# EAGLE design CanSwitch (EAGLE 7.7.0)
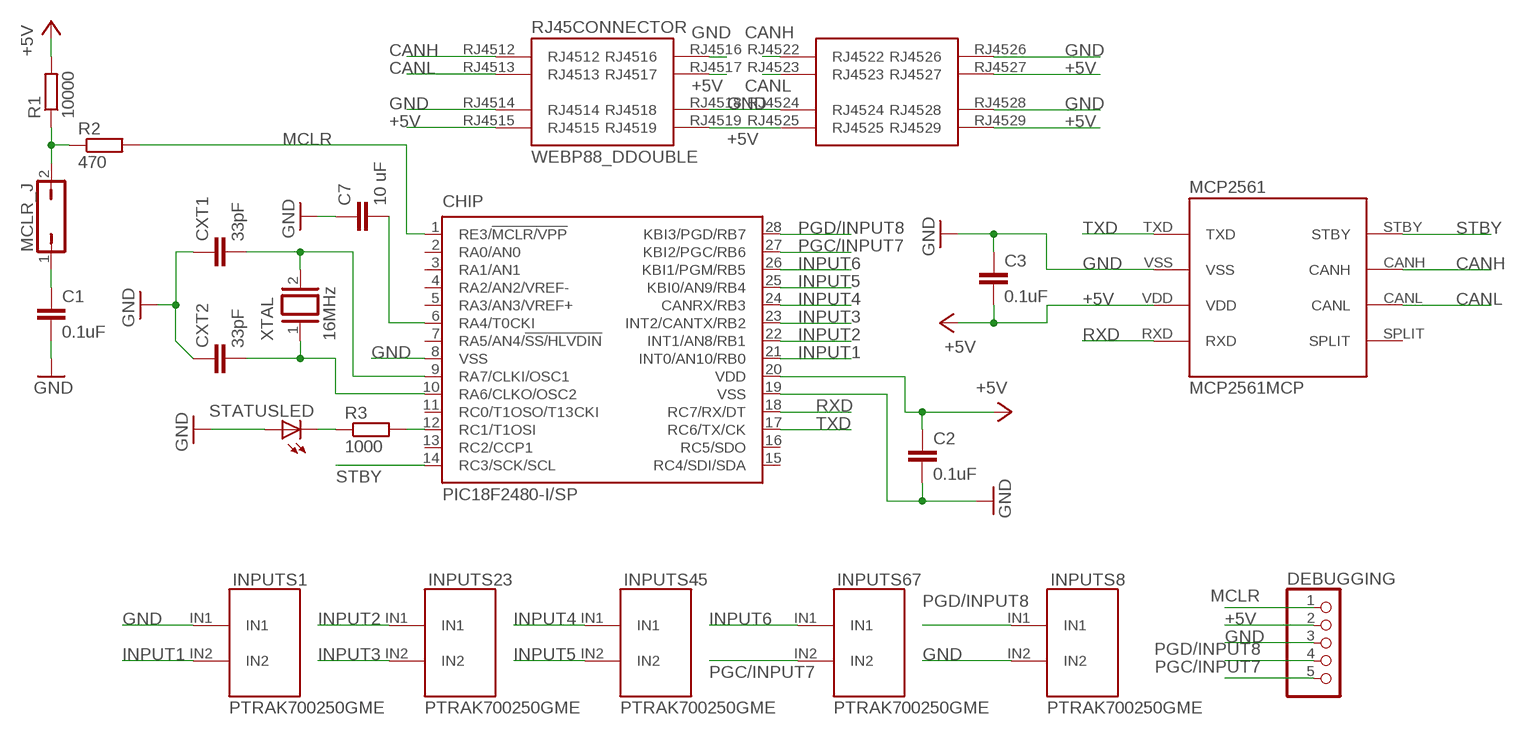
[diagram p0: schematic, sheet 1]

## Parts
C1  0.1uF  C-EU025-025X050  [C025-025X050]
C2  0.1uF  C-EU050-025X075  [C050-025X075]
C3  0.1uF  C-EU050-025X075  [C050-025X075]
C7  10 uF  C-EU050-025X075  [C050-025X075]
CHIP  PIC18F2480-I/SP  [DIL28-3]
CXT1  33pF  C-EU025-030X050  [C025-030X050]
CXT2  33pF  C-EU025-030X050  [C025-030X050]
DEBUGGING  PINHD-1X5  [1X05]
INPUTS1  PTRAK700250GME  [PTR_AK700_2_5.0]
INPUTS8  PTRAK700250GME  [PTR_AK700_2_5.0]
INPUTS23  PTRAK700250GME  [PTR_AK700_2_5.0]
INPUTS45  PTRAK700250GME  [PTR_AK700_2_5.0]
INPUTS67  PTRAK700250GME  [PTR_AK700_2_5.0]
MCLR_J  JP1Q  [JP1]
MCP2561  MCP2561MCP  [MCP2561_PDIP]
R1  10000  R-EU_0207/10  [0207/10]
R2  470  R-EU_0207/10  [0207/10]
R3  1000  R-EU_0207/10  [0207/10]
RJ45CONNECTOR  WEBP88_DDOUBLE  [WEBP88_RJ45_DOUBLE]
STATUSLED  LED5MM  [LED5MM]
XTAL  16MHz  XTAL/S  [QS]

## Nets
+5V: C2.1 C3.2 CHIP.20(VDD) DEBUGGING.2 MCP2561.VDD R1.2 RJ45CONNECTOR.RJ4515 RJ45CONNECTOR.RJ4517 RJ45CONNECTOR.RJ4519 RJ45CONNECTOR.RJ4525 RJ45CONNECTOR.RJ4527 RJ45CONNECTOR.RJ4529
CANH: MCP2561.CANH RJ45CONNECTOR.RJ4512 RJ45CONNECTOR.RJ4522
CANL: MCP2561.CANL RJ45CONNECTOR.RJ4513 RJ45CONNECTOR.RJ4523
GND: C1.2 C2.2 C3.1 C7.1 CHIP.8(VSS) CHIP.19(VSS) CXT1.1 CXT2.1 DEBUGGING.3 INPUTS1.IN1 INPUTS8.IN2 MCP2561.VSS RJ45CONNECTOR.RJ4514 RJ45CONNECTOR.RJ4516 RJ45CONNECTOR.RJ4518 RJ45CONNECTOR.RJ4524 RJ45CONNECTOR.RJ4526 RJ45CONNECTOR.RJ4528 STATUSLED.A
INPUT1: CHIP.21(INT0/AN10/RB0) INPUTS1.IN2
INPUT2: CHIP.22(INT1/AN8/RB1) INPUTS23.IN1
INPUT3: CHIP.23(INT2/CANTX/RB2) INPUTS23.IN2
INPUT4: CHIP.24(CANRX/RB3) INPUTS45.IN1
INPUT5: CHIP.25(KBI0/AN9/RB4) INPUTS45.IN2
INPUT6: CHIP.26(KBI1/PGM/RB5) INPUTS67.IN1
MCLR: CHIP.1(RE3/!MCLR/VPP) DEBUGGING.1 R2.2
N$1: C1.1 MCLR_J.1
N$2: MCLR_J.2 R1.1 R2.1
N$4: C7.2 CHIP.6(RA4/T0CKI)
N$7: CHIP.12(RC1/T1OSI) R3.2
N$8: R3.1 STATUSLED.K(C)
OSC1: CHIP.9(RA7/CLKI/OSC1) CXT1.2 XTAL.2
OSC2: CHIP.10(RA6/CLKO/OSC2) CXT2.2 XTAL.1
PGC/INPUT7: CHIP.27(KBI2/PGC/RB6) DEBUGGING.5 INPUTS67.IN2
PGD/INPUT8: CHIP.28(KBI3/PGD/RB7) DEBUGGING.4 INPUTS8.IN1
RXD: CHIP.18(RC7/RX/DT) MCP2561.RXD
STBY: CHIP.14(RC3/SCK/SCL) MCP2561.STBY
TXD: CHIP.17(RC6/TX/CK) MCP2561.TXD
Unconnected: CHIP.2(RA0/AN0) CHIP.3(RA1/AN1) CHIP.4(RA2/AN2/VREF-) CHIP.5(RA3/AN3/VREF+) CHIP.7(RA5/AN4/!SS/HLVDIN) CHIP.11(RC0/T1OSO/T13CKI) CHIP.13(RC2/CCP1) CHIP.15(RC4/SDI/SDA) CHIP.16(RC5/SDO) MCP2561.SPLIT

## Library data of the parts
C1-C3 C7 CXT1 CXT2 = rcl:C-EU: CAPACITOR, European symbol
CHIP = microchip:PIC18F2*80: 28-Pin Enhanced Flash Microcontrollers with ECAN(TM) Technology 10-Bit A/D and nanoWatt Technology Source: http://www.microchip.com .. 39637a.pdf; MF: MICROCHIP; MPN: PIC18F2480-I/SP; OC_FARNELL: 9321217; OC_NEWARK: 71J7237
DEBUGGING = pinhead:PINHD-1X5: PIN HEADER
INPUTS1 INPUTS8 INPUTS23 INPUTS45 INPUTS67 = PoJD:PTRAK700250: Šroubovací svorkovnice do DPS, zelená. Počet kontaktů = 2 Rozteč kontaktů = 5mm Jmenovité napětí = 250V Jmenovitý proud = 24A Orientace vodiče = vertikální Možnost spojování = ano Výrobce PTR
MCLR_J = jumper:JP1Q: JUMPER
MCP2561 = PoJD:MCP2561: High-Speed CAN Transceiver See http://ww1.microchip.com/downloads/en/DeviceDoc/25167A.pdf The MCP2561/2 is a Microchip Technology Inc. second generation high-speed CAN transceiver. It serves as an interface between a CAN protocol controller and the physical two-wire CAN bus. The device meets the automotive requirements for high-speed (up to 1 Mb/s), low quiescent current, electromagnetic compatibility (EMC) and electrostatic discharge (ESD).
R1-R3 = rcl:R-EU_: RESISTOR, European symbol
RJ45CONNECTOR = PoJD:WEBP88_D: RJ konektor WEBP 8-8 SHIELDED DVOJITY. http://www.gme.cz/rj-konektor-webp-8-8-shielded-dvojity-p833-064
STATUSLED = led:LED: LED OSRAM: - CHIPLED LG R971, LG N971, LY N971, LG Q971, LY Q971, LO R971, LY R971 LH N974, LH R974 LS Q976, LO Q976, LY Q976 LO Q996 - Hyper CHIPLED LW Q18S LB Q993, LB Q99A, LB R99A - SideLED LS A670, LO A670, LY A670, LG A670, LP A670 LB A673, LV A673, LT A673, LW A673 LH A674 LY A675 LS A676, LA A676, LO A676, LY A676, LW A676 LS A679, LY A679, LG A679 - Hyper Micro SIDELED® LS Y876, LA Y876, LO Y876, LY Y876 LT Y87S - SmartLED LW L88C, LW L88S LB L89C, LB L89S, LG L890 LS L89K, LO L89K, LY L89K LS L896, LA L896, LO L896, LY L896 - TOPLED LS T670, LO T670, LY T670, LG T670, LP T670 LSG T670, LSP T670, LSY T670, LOP T670, LYG T670 LG T671, LOG T671, LSG T671 LB T673, LV T673, LT T673, LW T673 LH T674 LS T676, LA T676, LO T676, LY T676, LB T676, LH T676, LSB T676, LW T676 LB T67C, LV T67C, LT T67C, LS T67K, LO T67K, LY T67K, LW E67C LS E67B, LA E67B, LO E67B, LY E67B, LB E67C, LV E67C, LT E67C LW T67C LS T679, LY T679, LG T679 LS T770, LO T770, LY T770, LG T770, LP T770 LB T773, LV T773, LT T773, LW T773 LH T774 LS E675, LA E675, LY E675, LS T675 LS T776, LA T776, LO T776, LY T776, LB T776 LHGB T686 LT T68C, LB T68C - Hyper Mini TOPLED® LB M676 - Mini TOPLED Santana® LG M470 LS M47K, LO M47K, LY M47K Source: http://www.osram.convergy.de LUXEON: - LUMILED® LXK2-PW12-R00, LXK2-PW12-S00, LXK2-PW14-U00, LXK2-PW14-V00 LXK2-PM12-R00, LXK2-PM12-S00, LXK2-PM14-U00 LXK2-PE12-Q00, LXK2-PE12-R00, LXK2-PE12-S00, LXK2-PE14-T00, LXK2-PE14-U00 LXK2-PB12-K00, LXK2-PB12-L00, LXK2-PB12-M00, LXK2-PB14-N00, LXK2-PB14-P00, LXK2-PB14-Q00 LXK2-PR12-L00, LXK2-PR12-M00, LXK2-PR14-Q00, LXK2-PR14-R00 LXK2-PD12-Q00, LXK2-PD12-R00, LXK2-PD12-S00 LXK2-PH12-R00, LXK2-PH12-S00 LXK2-PL12-P00, LXK2-PL12-Q00, LXK2-PL12-R00 Source: www.luxeon.com KINGBRIGHT: KA-3528ASYC Source: www.kingbright.com
XTAL = special:XTAL/S: CRYSTAL

## Board
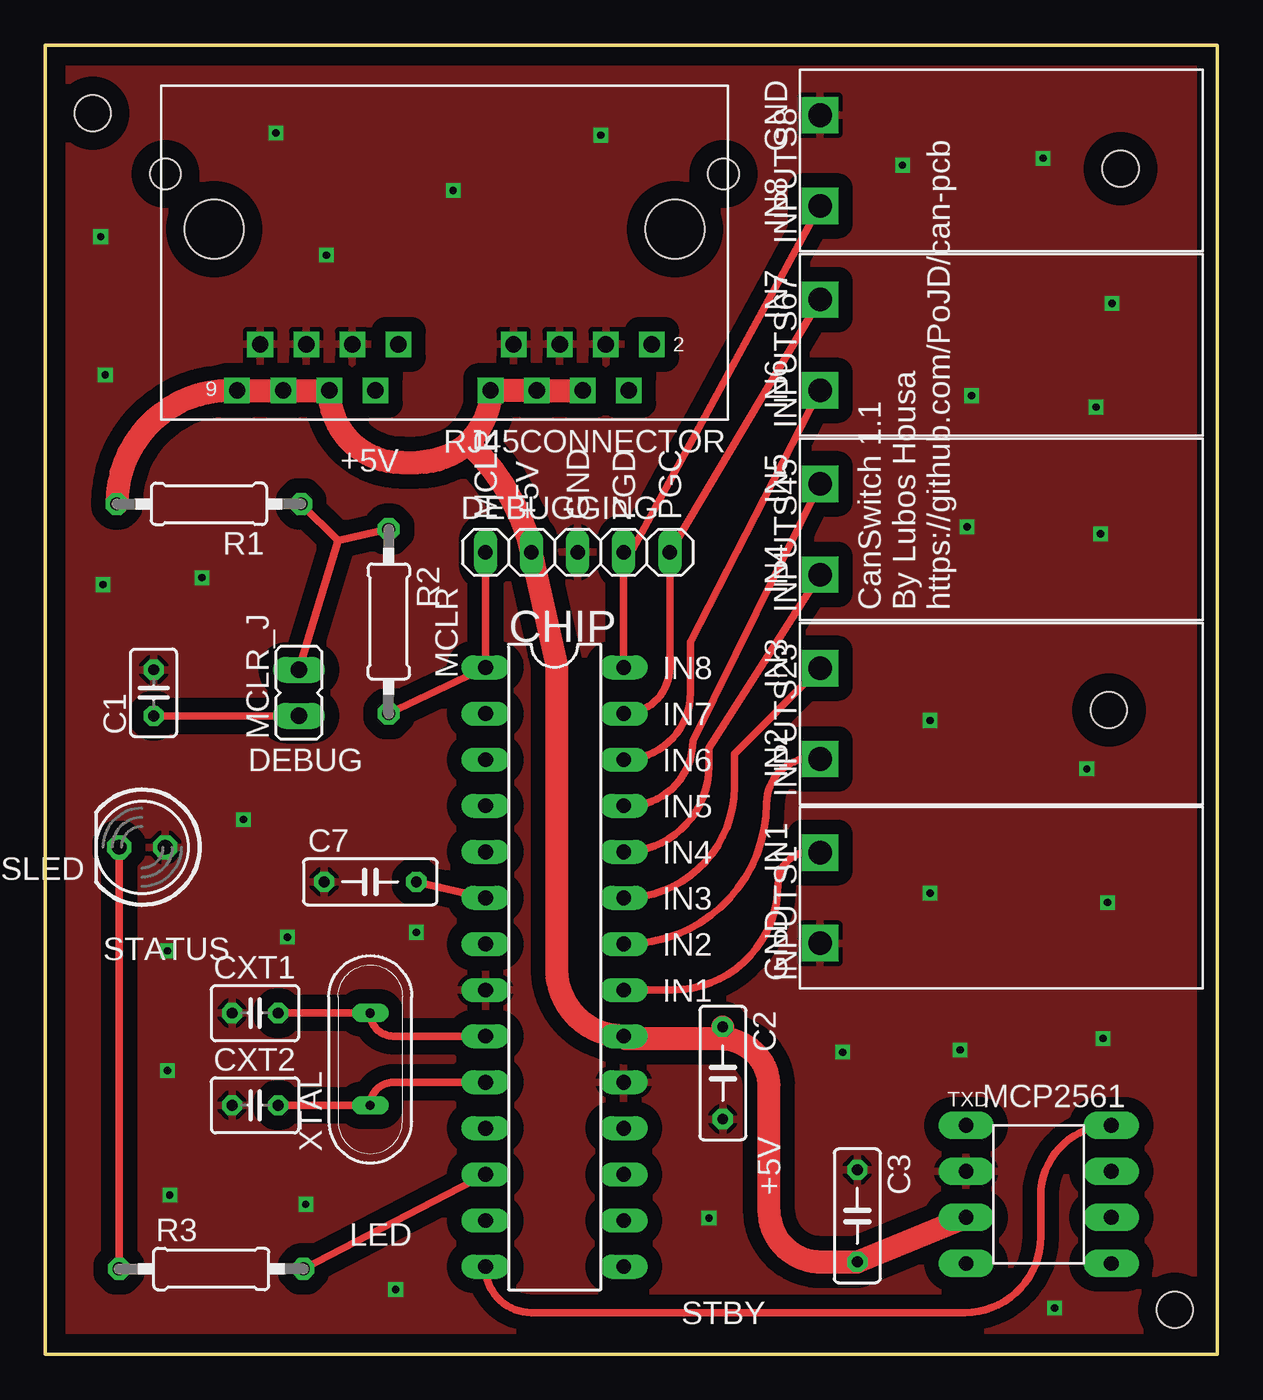
[diagram p1: board, top side]
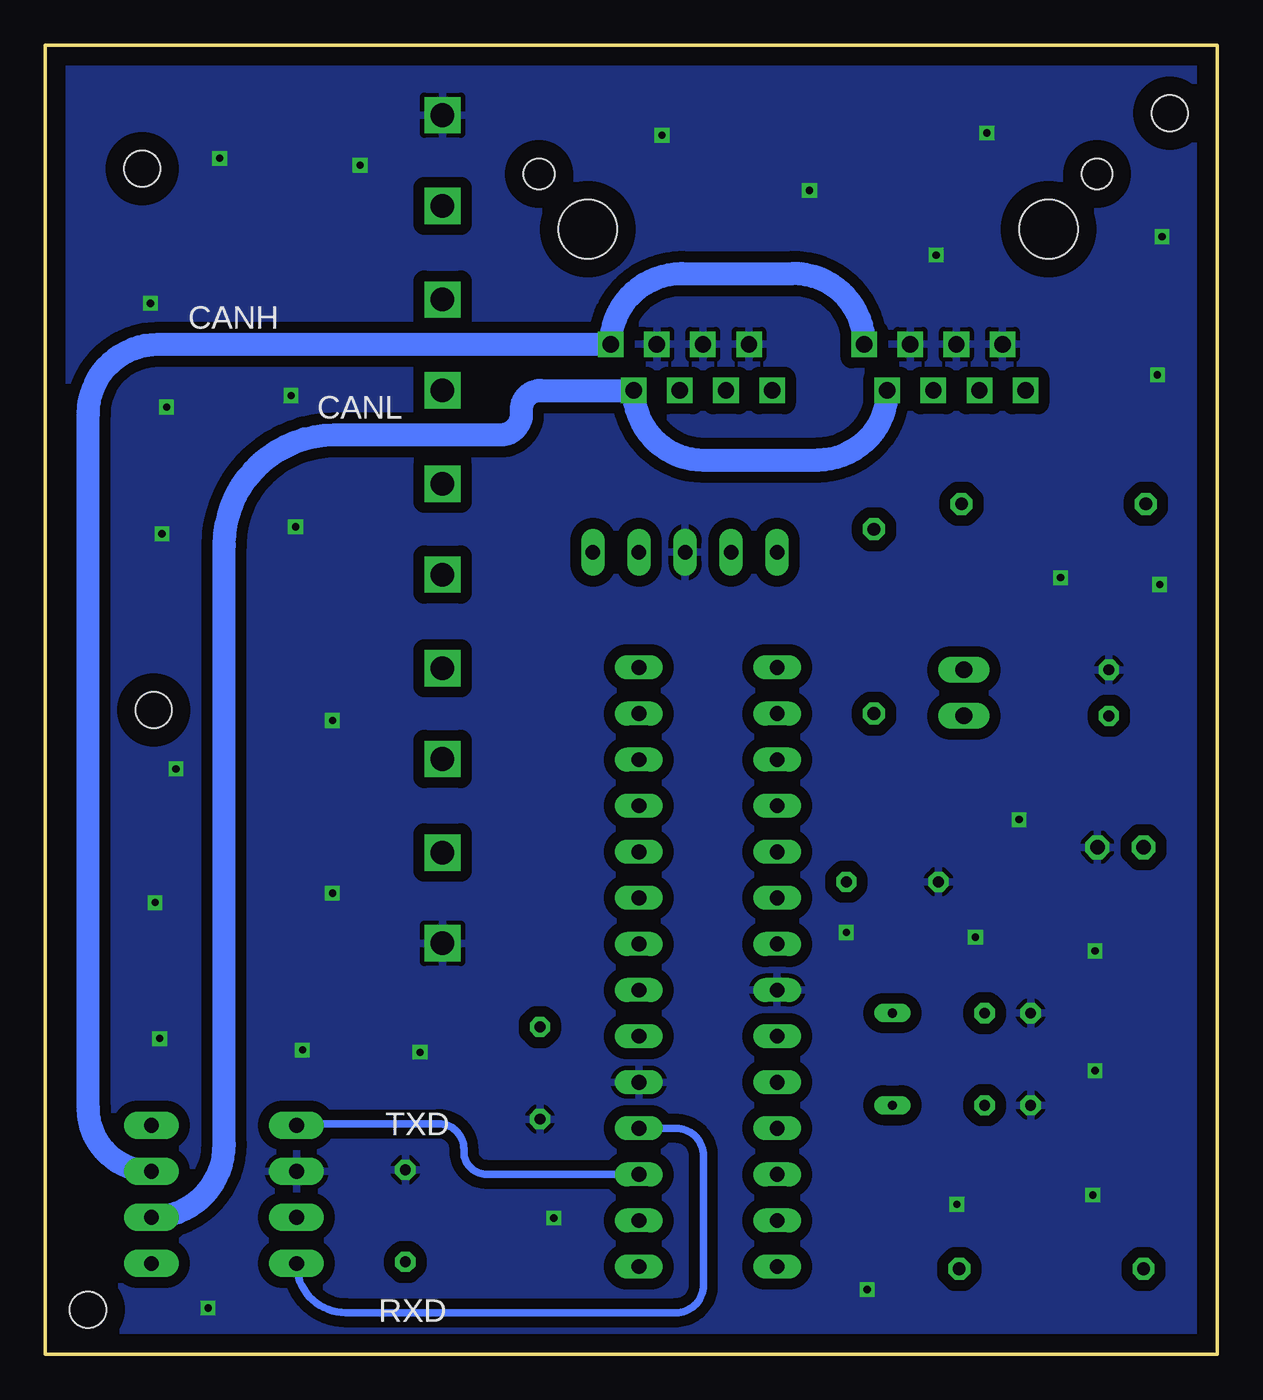
[diagram p2: board, bottom side, seen from below]

Size 64.59 x 72.14 mm. Coordinates in mm from the lower left corner, seen from the top.
Outline: 64.59,0 64.59,72.14 0,72.14 0,0 64.59,0
Copper layers (1*16): Top 0.035mm / dielectric 1.5mm / Bottom 0.035mm
Design rules "default *": minimum track width 10mil, minimum drill 0.3mm, track to track 8mil, track to pad 8mil, pad to pad 8mil, via to via 8mil, smd to smd 8mil, copper to edge 40mil, drill to drill 8mil, minimum pad ring 10mil, minimum via ring 8mil, stop-mask expansion 4mil, vias tented up to drill 0.41mm, thermal gap 10mil
Holes 2 mm at 2.62,68.39 62.25,2.46 58.63,35.5 59.26,65.34

### Footprints (pad centres in the part's own frame; a part is rotated, then mirrored left to right if it is on the bottom)
C025-025X050 = drill 0.6 octagon: 1 -1.27,0; 2 1.27,0
C050-025X075 = drill 0.6 octagon: 1 -2.54,0; 2 2.54,0
DIL28-3 = drill 0.813 long: 1 -16.51,-3.81; 2 -13.97,-3.81; 3 -11.43,-3.81; 4 -8.89,-3.81; 5 -6.35,-3.81; 6 -3.81,-3.81; 7 -1.27,-3.81; 8 1.27,-3.81; 9 3.81,-3.81; 10 6.35,-3.81; 11 8.89,-3.81; 12 11.43,-3.81; 13 13.97,-3.81; 14 16.51,-3.81; 15 16.51,3.81; 16 13.97,3.81; 17 11.43,3.81; 18 8.89,3.81; 19 6.35,3.81; 20 3.81,3.81; 21 1.27,3.81; 22 -1.27,3.81; 23 -3.81,3.81; 24 -6.35,3.81; 25 -8.89,3.81; 26 -11.43,3.81; 27 -13.97,3.81; 28 -16.51,3.81
C025-030X050 = drill 0.6 octagon: 1 -1.27,0; 2 1.27,0
1X05 = drill 0.8 long: 1 -5.08,0; 2 -2.54,0; 3 0,0; 4 2.54,0; 5 5.08,0
PTR_AK700_2_5.0 = drill 1.3 pad 2 square: IN1 -2.5,10; IN2 2.5,10
JP1 = drill 0.914 long: 1 0,-1.27; 2 0,1.27
MCP2561_PDIP = drill 0.813 pad 1.524 long: CANH 4,1.27; CANL 4,-1.27; RXD -4,-3.81; SPLIT 4,-3.81; STBY 4,3.81; TXD -4,3.81; VDD -4,-1.27; VSS -4,1.27
0207/10 = drill 0.7 octagon: 1 -5.08,0; 2 5.08,0
WEBP88_RJ45_DOUBLE = drill 0.9 square: RJ4512 -11.43,5.05; RJ4513 -10.16,7.59; RJ4514 -8.89,5.05; RJ4515 -7.62,7.59; RJ4516 -6.35,5.05; RJ4517 -5.08,7.59; RJ4518 -3.81,5.05; RJ4519 -2.54,7.59; RJ4522 2.54,5.05; RJ4523 3.81,7.59; RJ4524 5.08,5.05; RJ4525 6.35,7.59; RJ4526 7.62,5.05; RJ4527 8.89,7.59; RJ4528 10.16,5.05; RJ4529 11.43,7.59 | hole 3.25: -12.7,-1.3; 12.7,-1.3 | hole 1.7: -15.38,-4.35; 15.38,-4.35
LED5MM = drill 0.813 octagon: A -1.27,0; K 1.27,0
QS = drill 0.5 long: 1 -2.54,0; 2 2.54,0

### Placement (x,y rotation side)
C1  5.97,36.45 90 top
C2  37.34,15.49 270 top
C3  44.75,7.62 270 top
C7  17.91,26.04 0 top
CHIP  28.07,21.34 270 top
CXT1  11.56,18.8 0 top
CXT2  11.56,13.72 0 top
DEBUGGING  29.34,44.2 0 top
INPUTS1  52.7,25.15 90 top
INPUTS8  52.7,65.79 90 top
INPUTS23  52.7,35.31 90 top
INPUTS45  52.7,45.47 90 top
INPUTS67  52.7,55.63 90 top
MCLR_J  13.97,36.45 0 top
MCP2561  54.75,8.8 0 top
R1  9.02,46.86 180 top
R2  18.92,40.39 270 top
R3  9.14,4.7 0 top
RJ45CONNECTOR  22,60.71 180 top
STATUSLED  5.33,27.94 180 top
XTAL  17.91,16.26 90 top

### Tracks (layer width: path | path; a pad name or v marks a point on that pad's centre or on a via)
+5V
  Top 1.27: RJ45CONNECTOR.RJ4515 RJ45CONNECTOR.RJ4517 RJ45CONNECTOR.RJ4519 arc-90 20.57,49.15 | 37.21,17.4 32,17.4 arc-90 CHIP.20 arc-90 28.19,21.21 28.19,37.97 DEBUGGING.2 arc34 23.37,50.16 22.23,49.53 21.46,49.28 20.57,49.15 | 37.21,17.4 arc90 37.34,17.53 C2.1 | 37.21,17.4 arc-90 39.88,14.73 39.88,7.95 arc90 42.75,5.08 C3.2 MCP2561.VDD | R1.2 arc-90 10.19,53.12 RJ45CONNECTOR.RJ4529 RJ45CONNECTOR.RJ4527 RJ45CONNECTOR.RJ4525 arc90 19.62,49.15 20.57,49.15
CANH
  Bottom 1.27: RJ45CONNECTOR.RJ4522 arc-90 23.37,59.56 29.52,59.56 arc-90 RJ45CONNECTOR.RJ4512 58.39,55.66 arc-90 62.23,51.82 62.23,13.55 arc-90 MCP2561.CANH
CANL
  Bottom 1.27: RJ45CONNECTOR.RJ4523 arc90 22.03,49.28 28.32,49.28 arc90 RJ45CONNECTOR.RJ4513 37.31,53.12 arc-90 38.35,52.07 38.35,51.82 arc90 39.5,50.67 48.64,50.67 arc-90 54.74,44.58 54.74,11.55 arc90 MCP2561.CANL
GND  (via drill 0.4)
  other vias: 47.24,65.53 19.3,3.56 6.86,8.76 6.73,15.62 6.73,22.23 13.34,22.99 20.45,23.24 54.99,65.91 58.8,57.91 50.42,16.76 3.05,61.59 14.35,8.26 43.94,16.64 36.58,7.49 10.92,29.46 3.3,53.98 22.48,64.14 30.61,67.18 15.49,60.58 12.7,67.31 8.64,42.8 3.17,42.42 51.05,52.83 57.91,52.2 58.17,45.21 57.4,32.26 48.77,34.92 48.77,25.4 58.55,24.89 58.29,17.4 55.63,2.54 50.8,45.59
  pour Top (isolate 0.8): 0.5,71.64 64.09,71.64 64.09,0.5 0.5,0.5
  pour Bottom (isolate 0.6): 0.5,71.64 64.09,71.64 64.09,0.5 0.5,0.5
INPUT1
  Top 0.406: CHIP.21 34.54,20.07 arc90 40.39,25.91 arc-106 INPUTS1.IN2
INPUT2
  Top 0.406: CHIP.22 32,22.61 arc90 39.75,30.35 arc-101 INPUTS23.IN1
INPUT3
  Top 0.406: CHIP.23 arc90 37.97,31.24 37.97,33.07 INPUTS23.IN2
INPUT4
  Top 0.406: CHIP.24 arc90 36.58,32.38 36.58,33.4 INPUTS45.IN1
INPUT5
  Top 0.406: CHIP.25 32.13,30.23 arc90 35.69,33.78 INPUTS45.IN2
INPUT6
  Top 0.406: CHIP.26 arc90 35.56,36.45 35.56,39.24 INPUTS67.IN1
MCLR
  Top 0.406: DEBUGGING.1 CHIP.1 R2.2
N$1
  Top 0.406: MCLR_J.1 C1.1
N$2
  Top 0.406: MCLR_J.2 16.13,44.83 | 16.13,44.83 R2.1 | R1.1 16.13,44.83
N$4
  Top 0.406: CHIP.6 C7.2
N$7
  Top 0.406: CHIP.12 R3.2
N$8
  Top 0.406: R3.1 STATUSLED.K
OSC1
  Top 0.406: CXT1.2 XTAL.2 arc90 19.18,17.53 CHIP.9
OSC2
  Top 0.406: CXT2.2 XTAL.1 arc-90 19.18,14.99 CHIP.10
PGC/INPUT7
  Top 0.406: CHIP.27 arc90 34.42,37.85 DEBUGGING.5 INPUTS67.IN2
PGD/INPUT8
  Top 0.406: CHIP.28 31.88,43.43 | 31.88,43.43 DEBUGGING.4 | INPUTS8.IN1 31.88,43.43
RXD
  Bottom 0.406: CHIP.18 29.84,12.45 arc90 28.32,10.92 28.32,3.81 arc90 29.84,2.29 48.04,2.29 arc90 MCP2561.RXD
STBY
  Top 0.406: CHIP.14 arc90 26.8,2.29 50.67,2.29 arc90 54.86,6.48 54.86,8.73 arc-90 MCP2561.STBY
TXD
  Bottom 0.406: MCP2561.TXD arc90 50.67,12.7 42.93,12.7 arc90 41.53,11.3 41.53,11.18 arc-90 40.26,9.91 CHIP.17

### Text on the board
tPlace: GND | IN8 | IN7 | IN6 | +5V | IN5 | MCLR | +5V | GND | PGD | PGC | MCLR | IN4 | CanSwitch 1.1 / By Lubos Housa / https://github.com/PoJD/can-pcb | IN8 | IN3 | IN7 | DEBUG | IN6 | IN2 | IN5 | IN4 | IN1 | IN3 | STATUS | IN2 | GND | IN1 | +5V | LED | STBY
bPlace: CANH | CANL | TXD | RXD